# Altium schematic sheet PWR_Gen.SchDoc: uSDR schematic
size Letter; Author: Ye-sheng Kuo; CompanyName: Univ. of Michigan; Revision: 2.0; SheetNumber: 2; SheetTotal: 16
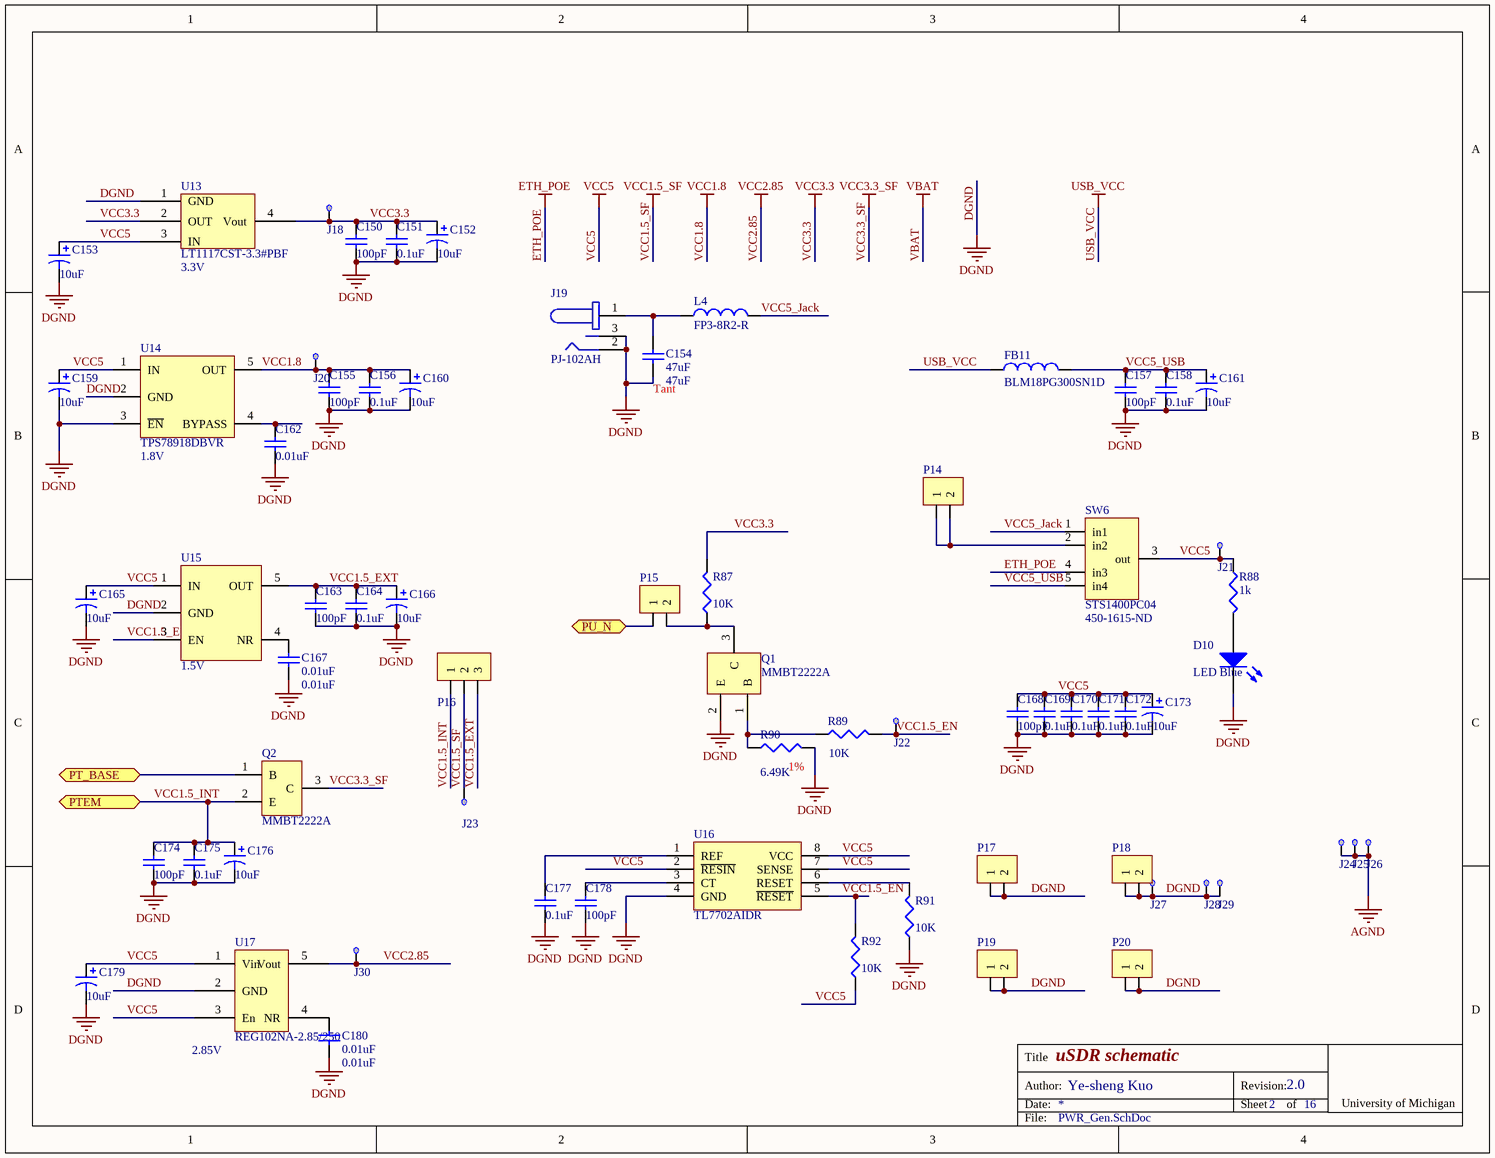
[diagram p0: PWR_Gen.SchDoc]

## Parts
C150  100pF  [0402]
C151  0.1uF  [0402]
C152  10uF  [C0805]
C153  10uF  [C0805]
C154  47uF  [C1210]
C155  100pF  [0402]
C156  0.1uF  [0402]
C157  100pF  [0402]
C158  0.1uF  [0402]
C159  10uF  [C0805]
C160  10uF  [C0805]
C161  10uF  [C0805]
C162  0.01uF  [0402]
C163  100pF  [0402]
C164  0.1uF  [0402]
C165  10uF  [C0805]
C166  10uF  [C0805]
C167  0.01uF  [0402]
C168  100pF  [0402]
C169  0.1uF  [0402]
C170  0.1uF  [0402]
C171  0.1uF  [0402]
C172  0.1uF  [0402]
C173  10uF  [C0805]
C174  100pF  [0402]
C175  0.1uF  [0402]
C176  10uF  [C0805]
C177  0.1uF  [0402]
C178  100pF  [0402]
C179  10uF  [C0805]
C180  0.01uF  [0402]
D10  LED Blue  [1608[0603]]
FB11  BLM18PG300SN1D  [1608[0603]]
J18  5004  [TestPoint]  (value not drawn)
J19  PJ-102AH  [PJ-102AH]
J20  5004  [TestPoint]  (value not drawn)
J21  5004  [TestPoint]  (value not drawn)
J22  5004  [TestPoint]  (value not drawn)
J23  5004  [TestPoint]  (value not drawn)
J24  5004  [TestPoint]  (value not drawn)
J25  5004  [TestPoint]  (value not drawn)
J26  5004  [TestPoint]  (value not drawn)
J27  5004  [TestPoint]  (value not drawn)
J28  5004  [TestPoint]  (value not drawn)
J29  5004  [TestPoint]  (value not drawn)
J30  5004  [TestPoint]  (value not drawn)
L4  FP3-8R2-R  [FLAT-PAC]
P14  1 x 2 header  [1x2 header]  (value not drawn)
P15  1 x 2 header  [1x2 header]  (value not drawn)
P16  1 x 3 header  [1x3 header]  (value not drawn)
P17  1 x 2 header  [1x2 header]  (value not drawn)
P18  1 x 2 header  [1x2 header]  (value not drawn)
P19  1 x 2 header  [1x2 header]  (value not drawn)
P20  1 x 2 header  [1x2 header]  (value not drawn)
Q1  MMBT2222A  [SOT23-3N]
Q2  MMBT2222A  [SOT23-3N]
R87  10K  [0402]
R88  1K  [0402]
R89  10K  [0402]
R90  6.49K  [0402]
R91  10K  [0402]
R92  10K  [0402]
SW6  STS1400PC04  Supplier Part Number 1: 450-1615-ND  [STS1400PC04]
U13  LT1117CST-3.3#PBF  value 3.3V  [SOT223-4L]
U14  TPS78918DBVR  value 1.8V  [SOT23-5]
U15  value 1.5V  [SOT23-5]  (hidden comment: TPS73115DBVT)
U16  TL7702AIDR  [SOIC127P600X175-8N]
U17  REG102NA-2.85/250  value 2.85V  [SOT23-5]

## Ports
PT_BASE, PTEM, PU_N

## Nets
AGND: J24.1(TB) J25.1(TB) J26.1(TB)
DGND: C150.1 C151.1 C152.2 C153.2 C154.1 C155.1 C156.1 C157.1 C158.1 C159.2 C160.2 C161.2 C162.1 C163.1 C164.1 C165.2 C166.2 C167.1 C168.1 C169.1 C170.1 C171.1 C172.1 C173.2 C174.1 C175.1 C176.2 C177.1 C178.1 C179.2 C180.1 D10.2(K) J19.2 J19.3 J27.1(TB) J28.1(TB) J29.1(TB) P17.1 P17.2 P18.1 P18.2 P19.1 P19.2 P20.1 P20.2 Q1.2(E) R90.2 R91.1 U13.1(GND) U14.2(GND) U14.3(~{EN}) U15.2(GND) U16.4(GND) U17.2(GND)
ETH_POE: SW6.4(in3)
USB_VCC: FB11.1
VCC1.5_SF: J23.1(TB) P16.2
VCC1.8: C155.2 C156.2 C160.1 J20.1(TB) U14.5(OUT)
VCC2.85: J30.1(TB) U17.5(Vout)
VCC3.3: C150.2 C151.2 C152.1 J18.1(TB) R87.2 U13.2(OUT) U13.4(Vout)
VCC3.3_SF: Q2.3(C)
VCC5: C153.1 C159.1 C165.1 C168.2 C169.2 C170.2 C171.2 C172.2 C173.1 C179.1 J21.1(TB) R88.1 R92.1 SW6.3(out) U13.3(IN) U14.1(IN) U15.1(IN) U16.2(~{RESIN}) U16.7(SENSE) U16.8(VCC) U17.1(Vin) U17.3(En)
PT_BASE: Q2.1(B) ; port PT_BASE
PU_N: P15.1 ; port PU_N
VCC1.5_EN: J22.1(TB) R89.2 R92.2 U15.3(EN) U16.5(~{RESET})
VCC1.5_EXT: C163.2 C164.2 C166.1 P16.3 U15.5(OUT)
VCC1.5_INT: C174.2 C175.2 C176.1 P16.1 Q2.2(E) ; port PTEM
VCC5_Jack: L4.2 SW6.1(in1)
VCC5_USB: C157.2 C158.2 C161.1 FB11.2 SW6.5(in4)
NetC154_2: C154.2 J19.1 L4.1
NetC162_2: C162.2 U14.4(BYPASS)
NetC167_2: C167.2 U15.4(NR)
NetC177_2: C177.2 U16.1(REF)
NetC178_2: C178.2 U16.3(CT)
NetC180_2: C180.2 U17.4(NR)
NetD10_1: D10.1(A) R88.2
NetP14_1: P14.1 P14.2 SW6.2(in2)
NetP15_2: P15.2 Q1.3(C) R87.1
NetQ1_1: Q1.1(B) R89.1 R90.1
NetR91_2: R91.2 U16.6(RESET)

## Notes on the sheet
- (near C154) Tant
- (near R90) 1%
- Title
- Date:
- Author:
- Revision:
- Sheet
- of
- University of Michigan
- File:

## Library data of the parts
C150 C151 C154-C158 C162-C164 C167-C172 C174 C175 C177 C178 C180 = Cap Semi: Capacitor (Semiconductor SIM Model); Published: 8-Jun-2000; LatestRevisionDate: 29-May-2009; LatestRevisionNote: IPC-7351 Footprint Added.; PackageReference: C1206; Publisher: Altium Limited; PackageDescription: Chip Capacitor
  C150 C155 C157 C163 C168 C174 C178: Value: 100pF
  C151 C156 C158 C164 C169-C172 C175 C177: Value: 0.1uF
  C154: Value: 47uF
  C162 C167 C180: Value: 0.01uF
C152 C153 C159-C161 C165 C166 C173 C176 C179 = Cap Pol3: Polarized Capacitor (Surface Mount); Published: 8-Jun-2000; LatestRevisionDate: 29-May-2009; LatestRevisionNote: IPC-7351 Footprint Added.; PackageReference: C0805; Publisher: Altium Limited; PackageDescription: Chip Capacitor; Value: 10uF
D10 = LED2: Typical RED, GREEN, YELLOW, AMBER GaAs LED; Published: 8-Jun-2000; LatestRevisionDate: 17-Jul-2002; LatestRevisionNote: Re-released for DXP Platform.; PackageVersion: Feb-2002; PackageReference: 3.2X1.6X1.1; Publisher: Altium Limited; PackageDescription: SM LED; 2 Flat Leads
FB11 = Ferrite Bead: FERRITE CHIP 30 OHM 1000MA 0603; Supplier 1: Digi-Key; Supplier Part Number 1: 490-1035-2-ND
J18 J20-J30 = TestPoint: TEST POINT PC MINI .040"D YELLOW; Supplier 1: Digi-Key; Supplier Part Number 1: 5004K-ND; datasheet: http://mail.keyelco.com/ENG._DEPT/PDF%20CAT%20NO%20Drawings/5004.pdf
J19 = PJ-102AH: CONN PWR JACK 2.1X5.5MM HIGH CUR; Supplier 1: Digi-Key; Supplier Part Number 1: CP-102AH-ND
L4 = Inductor: Code_IEC: 1005; Value: 10mH; Published: 8-Jun-2000; LatestRevisionDate: 29-May-2009; LatestRevisionNote: IPC-7351 Footprint Added.; PackageReference: 0402-A; Publisher: Altium Limited; PackageDescription: Chip Inductor; Code_JEITA: 0402
P14 P15 P17-P20 = 1 x 2 header: 100 mils standard header
P16 = 1 x 3 header: 100 mils standard header
Q1 Q2 = MMBT2222A: TRANSISTOR NPN GP 40V SOT23; Supplier 1: Digi-Key; Supplier Part Number 1: MMBT2222ATPMSCT-ND
R87-R92 = Res3: Resistor; Published: 8-Jun-2000; LatestRevisionDate: 29-May-2009; LatestRevisionNote: IPC-7351 Footprint Added.; PackageReference: J1-0603; Publisher: Altium Limited; PackageDescription: Chip Resistor
  R87 R89 R91 R92: Value: 10K
  R88: Value: 1k
  R90: Value: 6.49K
SW6 = STS1400PC04: Switch Slide 4 postions; Supplier 1: Digi-Key
U13 = LT1117-3.3: IC REG LDO 3.3V SOT-223; Supplier 1: Digi-Key; Supplier Part Number 1: LT1117CST-3.3#PBF-ND
U14 = TPS789 LDO: IC 1.8V 100MA LDO REG SOT-23-5; Supplier 1: Digi-Key; Supplier Part Number 1: 296-8147-1-ND
U15 = TPS731: IC LDO REG 150MA 1.5V SOT23-5; Supplier 1: Digi-Key; Supplier Part Number 1: 296-15801-1-ND
U16 = TL7702AIDR: IC SUPPLY VOLT SUPERVISOR 8-SOIC; Supplier 1: Digi-Key; Supplier Part Number 1: 296-15017-1-ND
U17 = REG102/103/104: IC REG LDO 2.85V 250MA SOT23-5; Supplier 1: Digi-Key; Supplier Part Number 1: REG102NA-2.85CT-ND